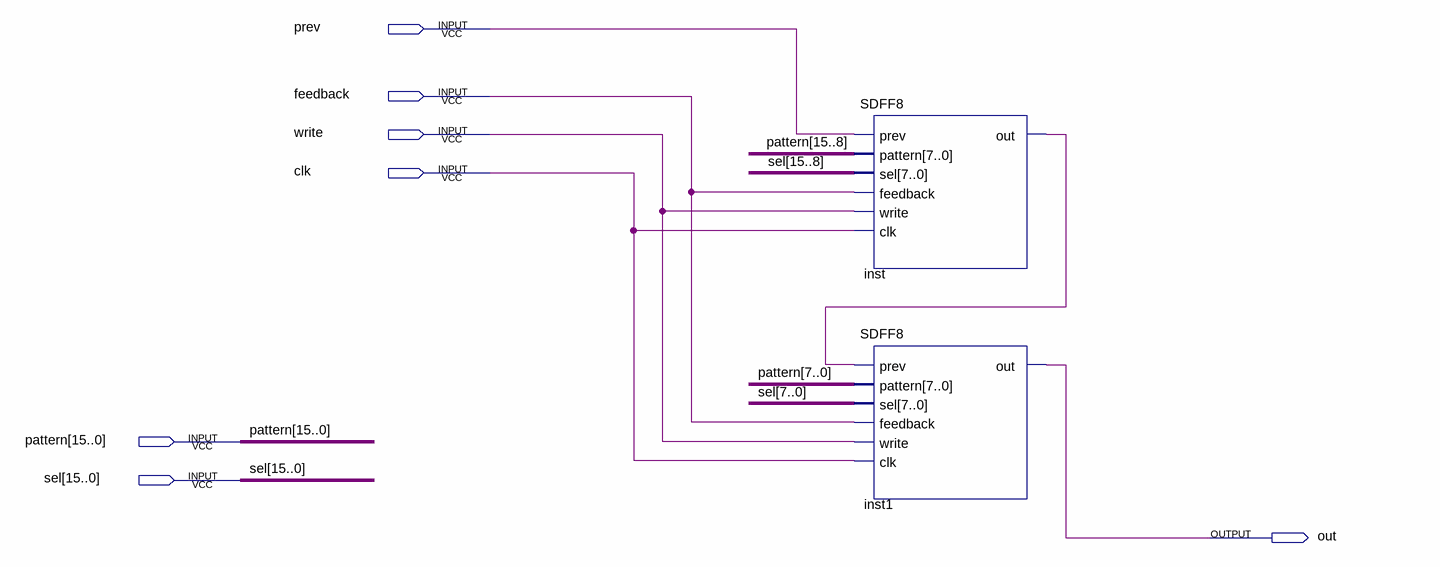
[diagram p0: schematic sheet]
// Quartus schematic SDFF16.bdf as structural Verilog: 2 symbols, 7 pins
module SDFF16 (
  input  prev,
  input  feedback,
  input  write,
  input  clk,
  input  [15:0] pattern,
  input  [15:0] sel,
  output out
);

  wire inst_out;

  SDFF8 inst (
    .prev(prev), .pattern(pattern[15:8]), .sel(sel[15:8]), .feedback(feedback), .write(write), .clk(clk),
    .out(inst_out));
  SDFF8 inst1 (
    .prev(inst_out), .pattern(pattern[7:0]), .sel(sel[7:0]), .feedback(feedback), .write(write), .clk(clk),
    .out(out));
endmodule
